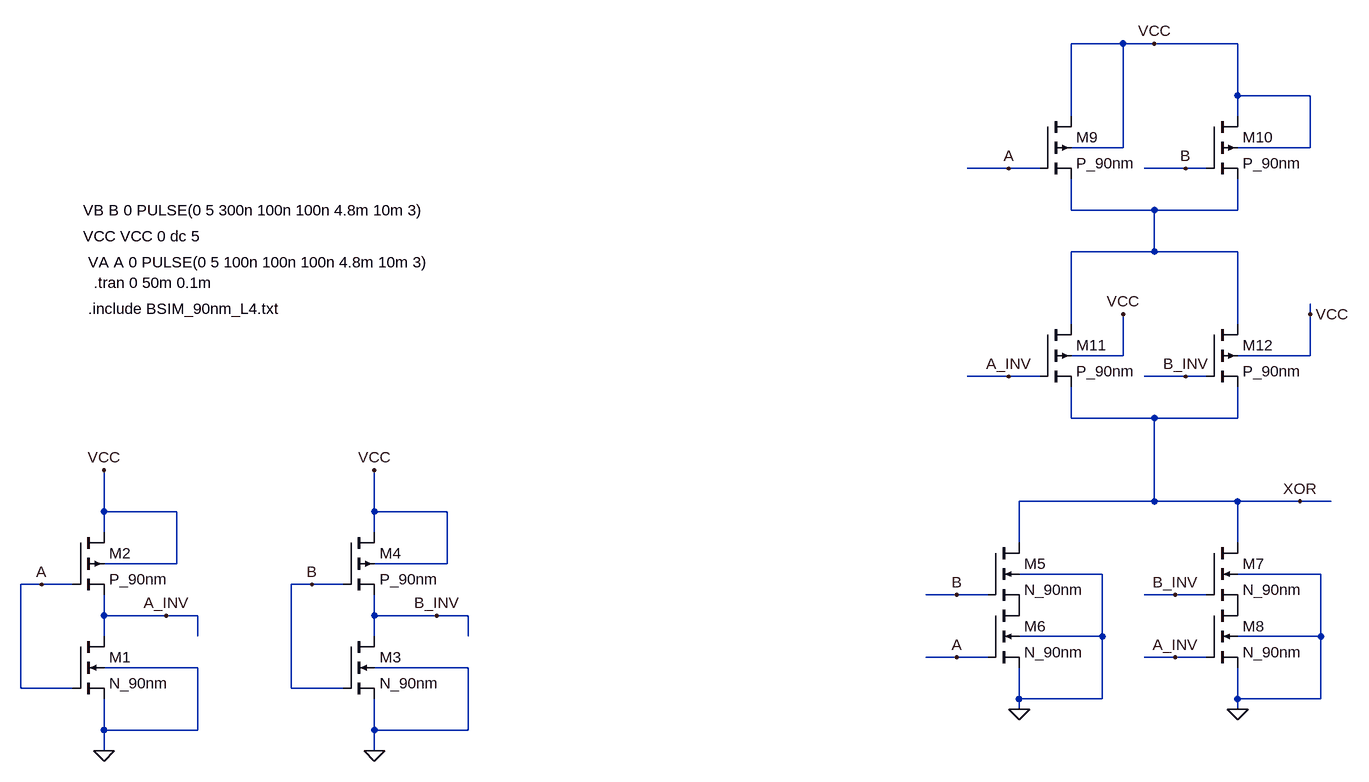
[diagram p0: schematic Draft2.asc]
Draft2.asc, the LTspice schematic file:
Version 4
SHEET 1 2240 680
WIRE 976 -608 896 -608
WIRE 1024 -608 976 -608
WIRE 1152 -608 1024 -608
WIRE 1152 -528 1152 -608
WIRE 1264 -528 1152 -528
WIRE 896 -496 896 -608
WIRE 1152 -496 1152 -528
WIRE 976 -448 976 -608
WIRE 976 -448 896 -448
WIRE 1264 -448 1264 -528
WIRE 1264 -448 1152 -448
WIRE 800 -416 736 -416
WIRE 848 -416 800 -416
WIRE 1072 -416 1008 -416
WIRE 1104 -416 1072 -416
WIRE 896 -352 896 -400
WIRE 1024 -352 896 -352
WIRE 1152 -352 1152 -400
WIRE 1152 -352 1024 -352
WIRE 1024 -288 1024 -352
WIRE 1024 -288 896 -288
WIRE 1152 -288 1024 -288
WIRE 1264 -192 1264 -208
WIRE 896 -176 896 -288
WIRE 1152 -176 1152 -288
WIRE 976 -128 976 -192
WIRE 976 -128 896 -128
WIRE 1264 -128 1264 -192
WIRE 1264 -128 1152 -128
WIRE 800 -96 736 -96
WIRE 848 -96 800 -96
WIRE 1072 -96 1008 -96
WIRE 1104 -96 1072 -96
WIRE 896 -32 896 -80
WIRE 1024 -32 896 -32
WIRE 1152 -32 1152 -80
WIRE 1152 -32 1024 -32
WIRE 1024 96 1024 -32
WIRE 1024 96 816 96
WIRE 1152 96 1024 96
WIRE 1248 96 1152 96
WIRE 1296 96 1248 96
WIRE -592 112 -592 48
WIRE -480 112 -592 112
WIRE -176 112 -176 48
WIRE -64 112 -176 112
WIRE -592 144 -592 112
WIRE -176 144 -176 112
WIRE 816 160 816 96
WIRE 1152 160 1152 96
WIRE -480 192 -480 112
WIRE -480 192 -592 192
WIRE -64 192 -64 112
WIRE -64 192 -176 192
WIRE 944 208 816 208
WIRE 1280 208 1152 208
WIRE -688 224 -720 224
WIRE -640 224 -688 224
WIRE -272 224 -304 224
WIRE -224 224 -272 224
WIRE 720 240 672 240
WIRE 768 240 720 240
WIRE 1056 240 1008 240
WIRE 1104 240 1056 240
WIRE -592 272 -592 240
WIRE -496 272 -592 272
WIRE -448 272 -496 272
WIRE -176 272 -176 240
WIRE -80 272 -176 272
WIRE -32 272 -80 272
WIRE -592 304 -592 272
WIRE -448 304 -448 272
WIRE -176 304 -176 272
WIRE -32 304 -32 272
WIRE 944 304 944 208
WIRE 944 304 816 304
WIRE 1280 304 1280 208
WIRE 1280 304 1152 304
WIRE 720 336 672 336
WIRE 768 336 720 336
WIRE 1056 336 1008 336
WIRE 1104 336 1056 336
WIRE -448 352 -592 352
WIRE -32 352 -176 352
WIRE -720 384 -720 224
WIRE -640 384 -720 384
WIRE -304 384 -304 224
WIRE -224 384 -304 384
WIRE 816 400 816 352
WIRE 944 400 944 304
WIRE 944 400 816 400
WIRE 1152 400 1152 352
WIRE 1280 400 1280 304
WIRE 1280 400 1152 400
WIRE 816 416 816 400
WIRE 1152 416 1152 400
WIRE -592 448 -592 400
WIRE -448 448 -448 352
WIRE -448 448 -592 448
WIRE -176 448 -176 400
WIRE -32 448 -32 352
WIRE -32 448 -176 448
WIRE -592 480 -592 448
WIRE -176 480 -176 448
FLAG -688 224 A
FLAG -496 272 A_INV
FLAG -592 480 0
FLAG -592 48 VCC
FLAG -272 224 B
FLAG -80 272 B_INV
FLAG -176 480 0
FLAG -176 48 VCC
FLAG 720 336 A
FLAG 720 240 B
FLAG 816 416 0
FLAG 1056 336 A_INV
FLAG 1056 240 B_INV
FLAG 1152 416 0
FLAG 1248 96 XOR
FLAG 1024 -608 VCC
FLAG 800 -416 A
FLAG 1072 -416 B
FLAG 800 -96 A_INV
FLAG 1072 -96 B_INV
FLAG 1264 -192 VCC
FLAG 976 -192 VCC
SYMBOL nmos4 -640 304 R0
SYMATTR InstName M1
SYMATTR Value N_90nm
SYMATTR Value2 l=90nm w=400nm
SYMBOL pmos4 -640 144 R0
SYMATTR InstName M2
SYMATTR Value P_90nm
SYMATTR Value2 l=90nm w=800nm
SYMBOL nmos4 -224 304 R0
SYMATTR InstName M3
SYMATTR Value N_90nm
SYMATTR Value2 l=90nm w=400nm
SYMBOL pmos4 -224 144 R0
SYMATTR InstName M4
SYMATTR Value P_90nm
SYMATTR Value2 l=90nm w=800nm
SYMBOL nmos4 768 160 R0
SYMATTR InstName M5
SYMATTR Value N_90nm
SYMATTR Value2 l=90nm w=400nm
SYMBOL nmos4 768 256 R0
SYMATTR InstName M6
SYMATTR Value N_90nm
SYMATTR Value2 l=90nm w=400nm
SYMBOL nmos4 1104 160 R0
SYMATTR InstName M7
SYMATTR Value N_90nm
SYMATTR Value2 l=90nm w=400nm
SYMBOL nmos4 1104 256 R0
SYMATTR InstName M8
SYMATTR Value N_90nm
SYMATTR Value2 l=90nm w=400nm
SYMBOL pmos4 848 -496 R0
SYMATTR InstName M9
SYMATTR Value P_90nm
SYMATTR Value2 l=90nm w=800nm
SYMBOL pmos4 1104 -496 R0
SYMATTR InstName M10
SYMATTR Value P_90nm
SYMATTR Value2 l=90nm w=800nm
SYMBOL pmos4 848 -176 R0
SYMATTR InstName M11
SYMATTR Value P_90nm
SYMATTR Value2 l=90nm w=800nm
SYMBOL pmos4 1104 -176 R0
SYMATTR InstName M12
SYMATTR Value P_90nm
SYMATTR Value2 l=90nm w=800nm
TEXT -624 -312 Left 2 !VCC VCC 0 dc 5
TEXT -616 -272 Left 2 !VA A 0 PULSE(0 5 100n 100n 100n 4.8m 10m 3)
TEXT -608 -240 Left 2 !.tran 0 50m 0.1m
TEXT -616 -200 Left 2 !.include BSIM_90nm_L4.txt
TEXT -624 -352 Left 2 !VB B 0 PULSE(0 5 300n 100n 100n 4.8m 10m 3)

The netlist it stands for:
* Draft2.asc
M1 A_INV A 0 0 N_90nm l=90nm w=400nm
M2 VCC A A_INV VCC P_90nm l=90nm w=800nm
M3 B_INV B 0 0 N_90nm l=90nm w=400nm
M4 VCC B B_INV VCC P_90nm l=90nm w=800nm
M5 XOR B P001 0 N_90nm l=90nm w=400nm
M6 P001 A 0 0 N_90nm l=90nm w=400nm
M7 XOR B_INV P002 0 N_90nm l=90nm w=400nm
M8 P002 A_INV 0 0 N_90nm l=90nm w=400nm
M9 VCC A N001 VCC P_90nm l=90nm w=800nm
M10 VCC B N001 VCC P_90nm l=90nm w=800nm
M11 N001 A_INV XOR VCC P_90nm l=90nm w=800nm
M12 N001 B_INV XOR VCC P_90nm l=90nm w=800nm
.model NMOS NMOS
.model PMOS PMOS
.lib standard.mos
VCC VCC 0 dc 5
VA A 0 PULSE(0 5 100n 100n 100n 4.8m 10m 3)
.tran 0 50m 0.1m
.include BSIM_90nm_L4.txt
VB B 0 PULSE(0 5 300n 100n 100n 4.8m 10m 3)
.backanno
.end